# EAGLE board Robot (EAGLE 6.5.0)
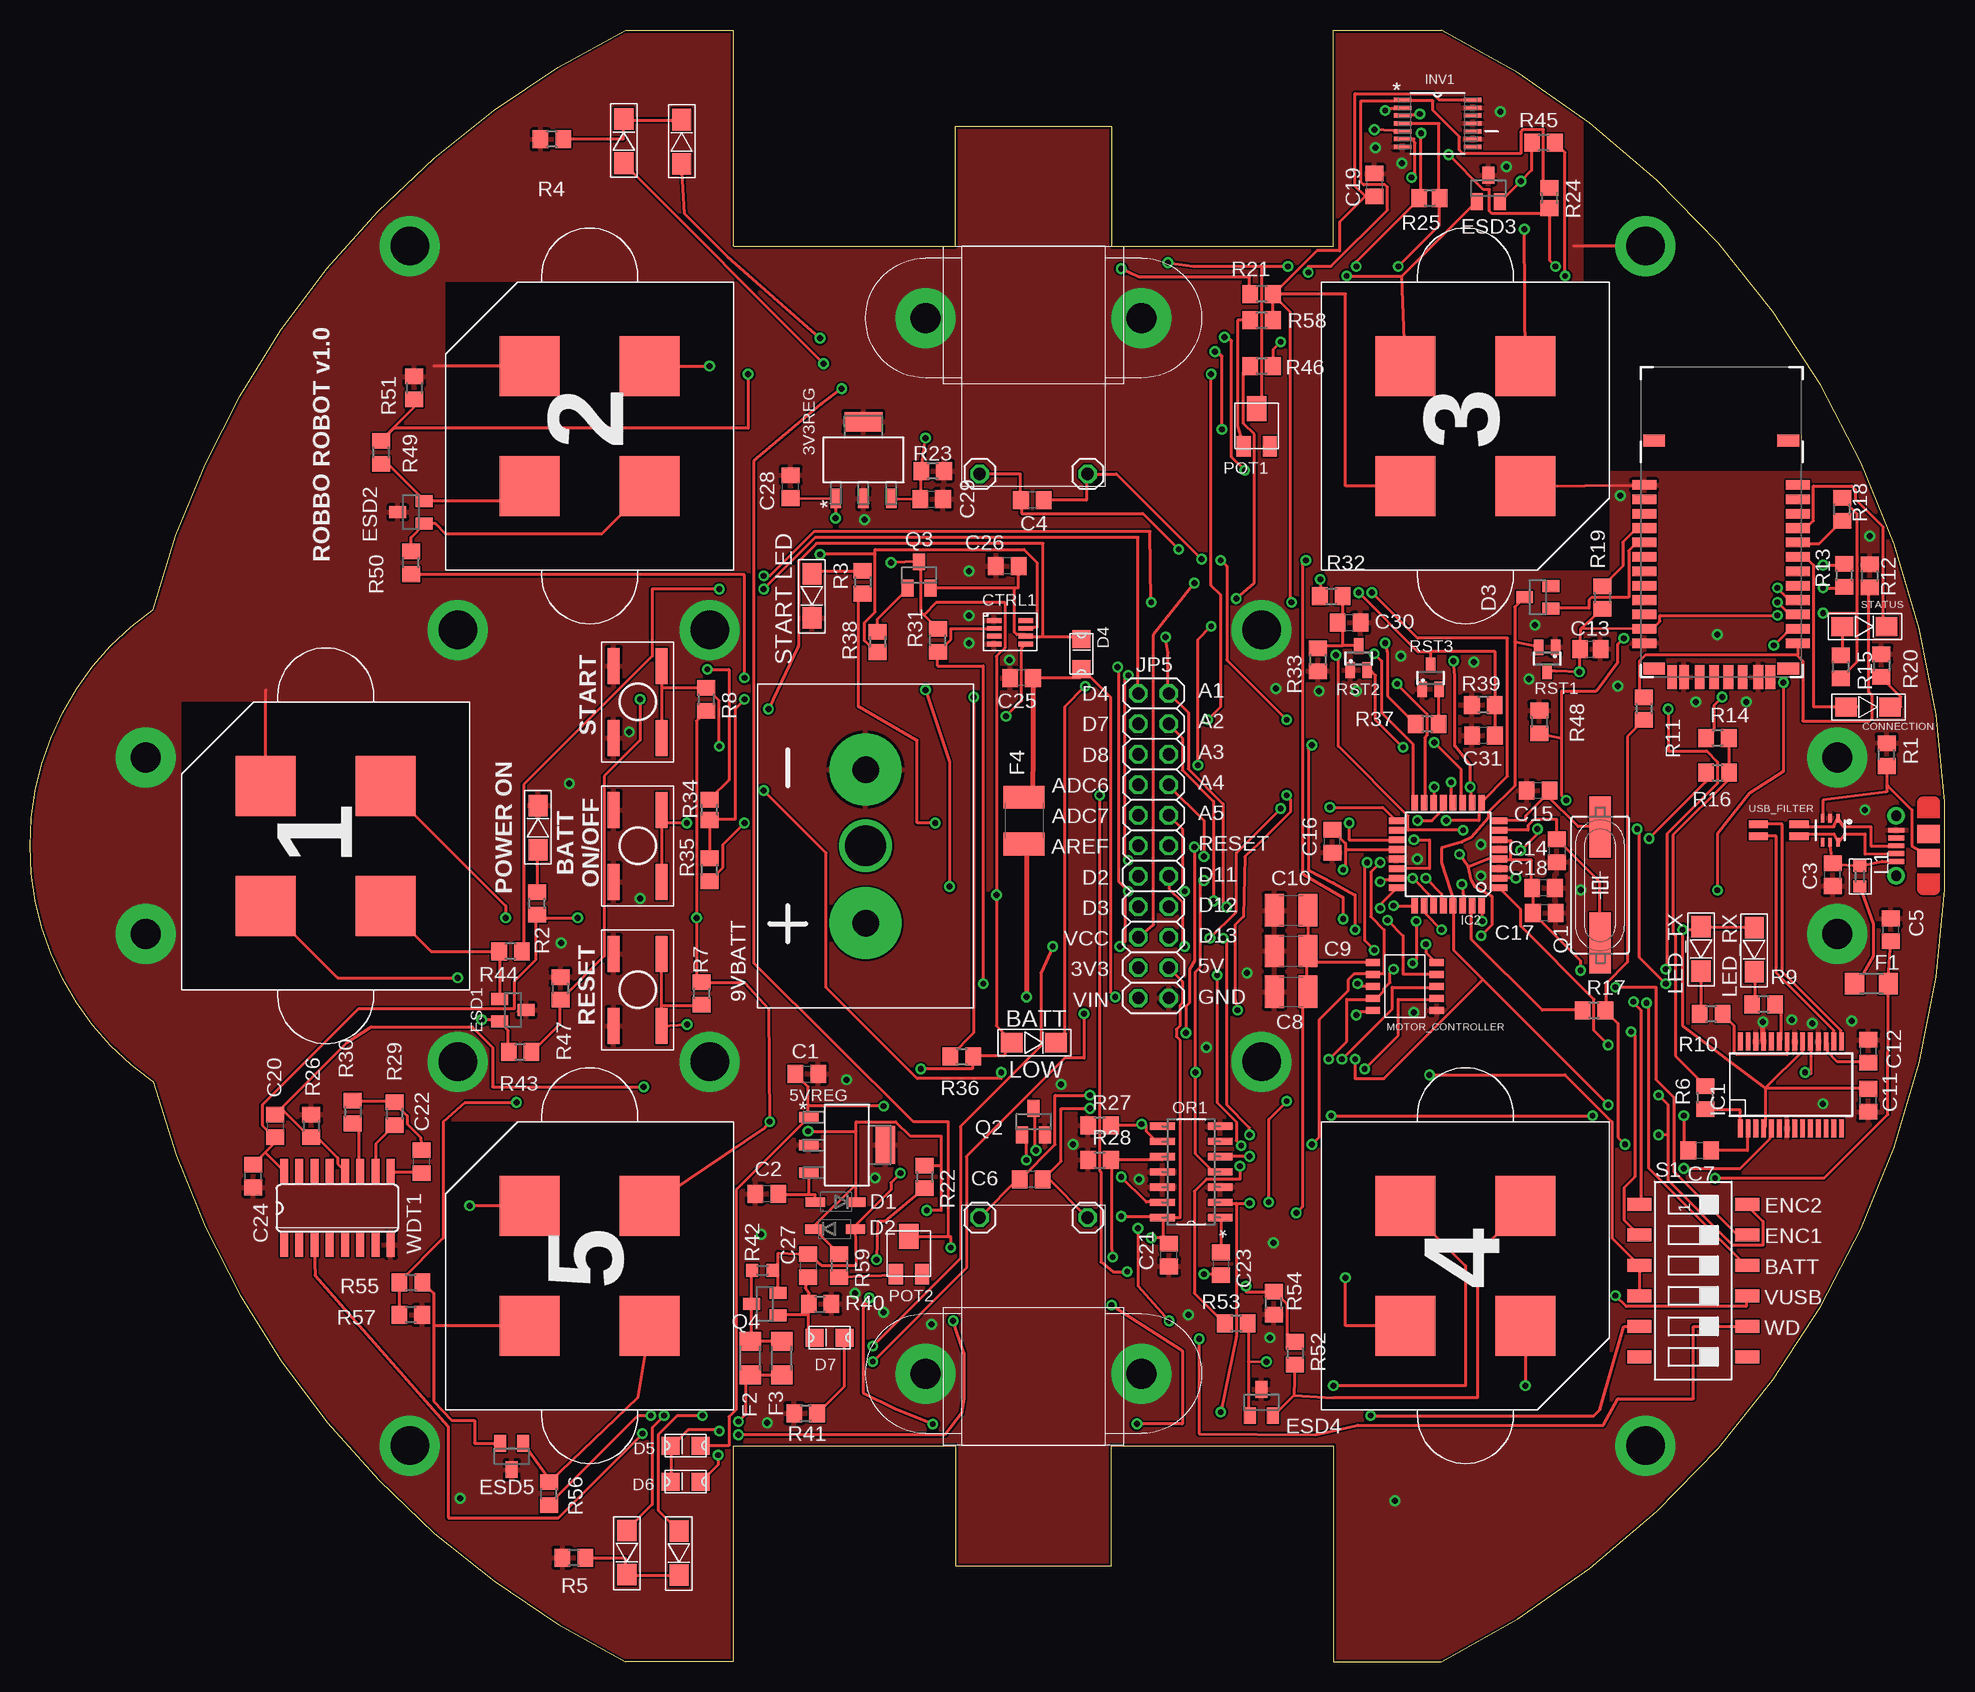
[diagram p4: board, top side]
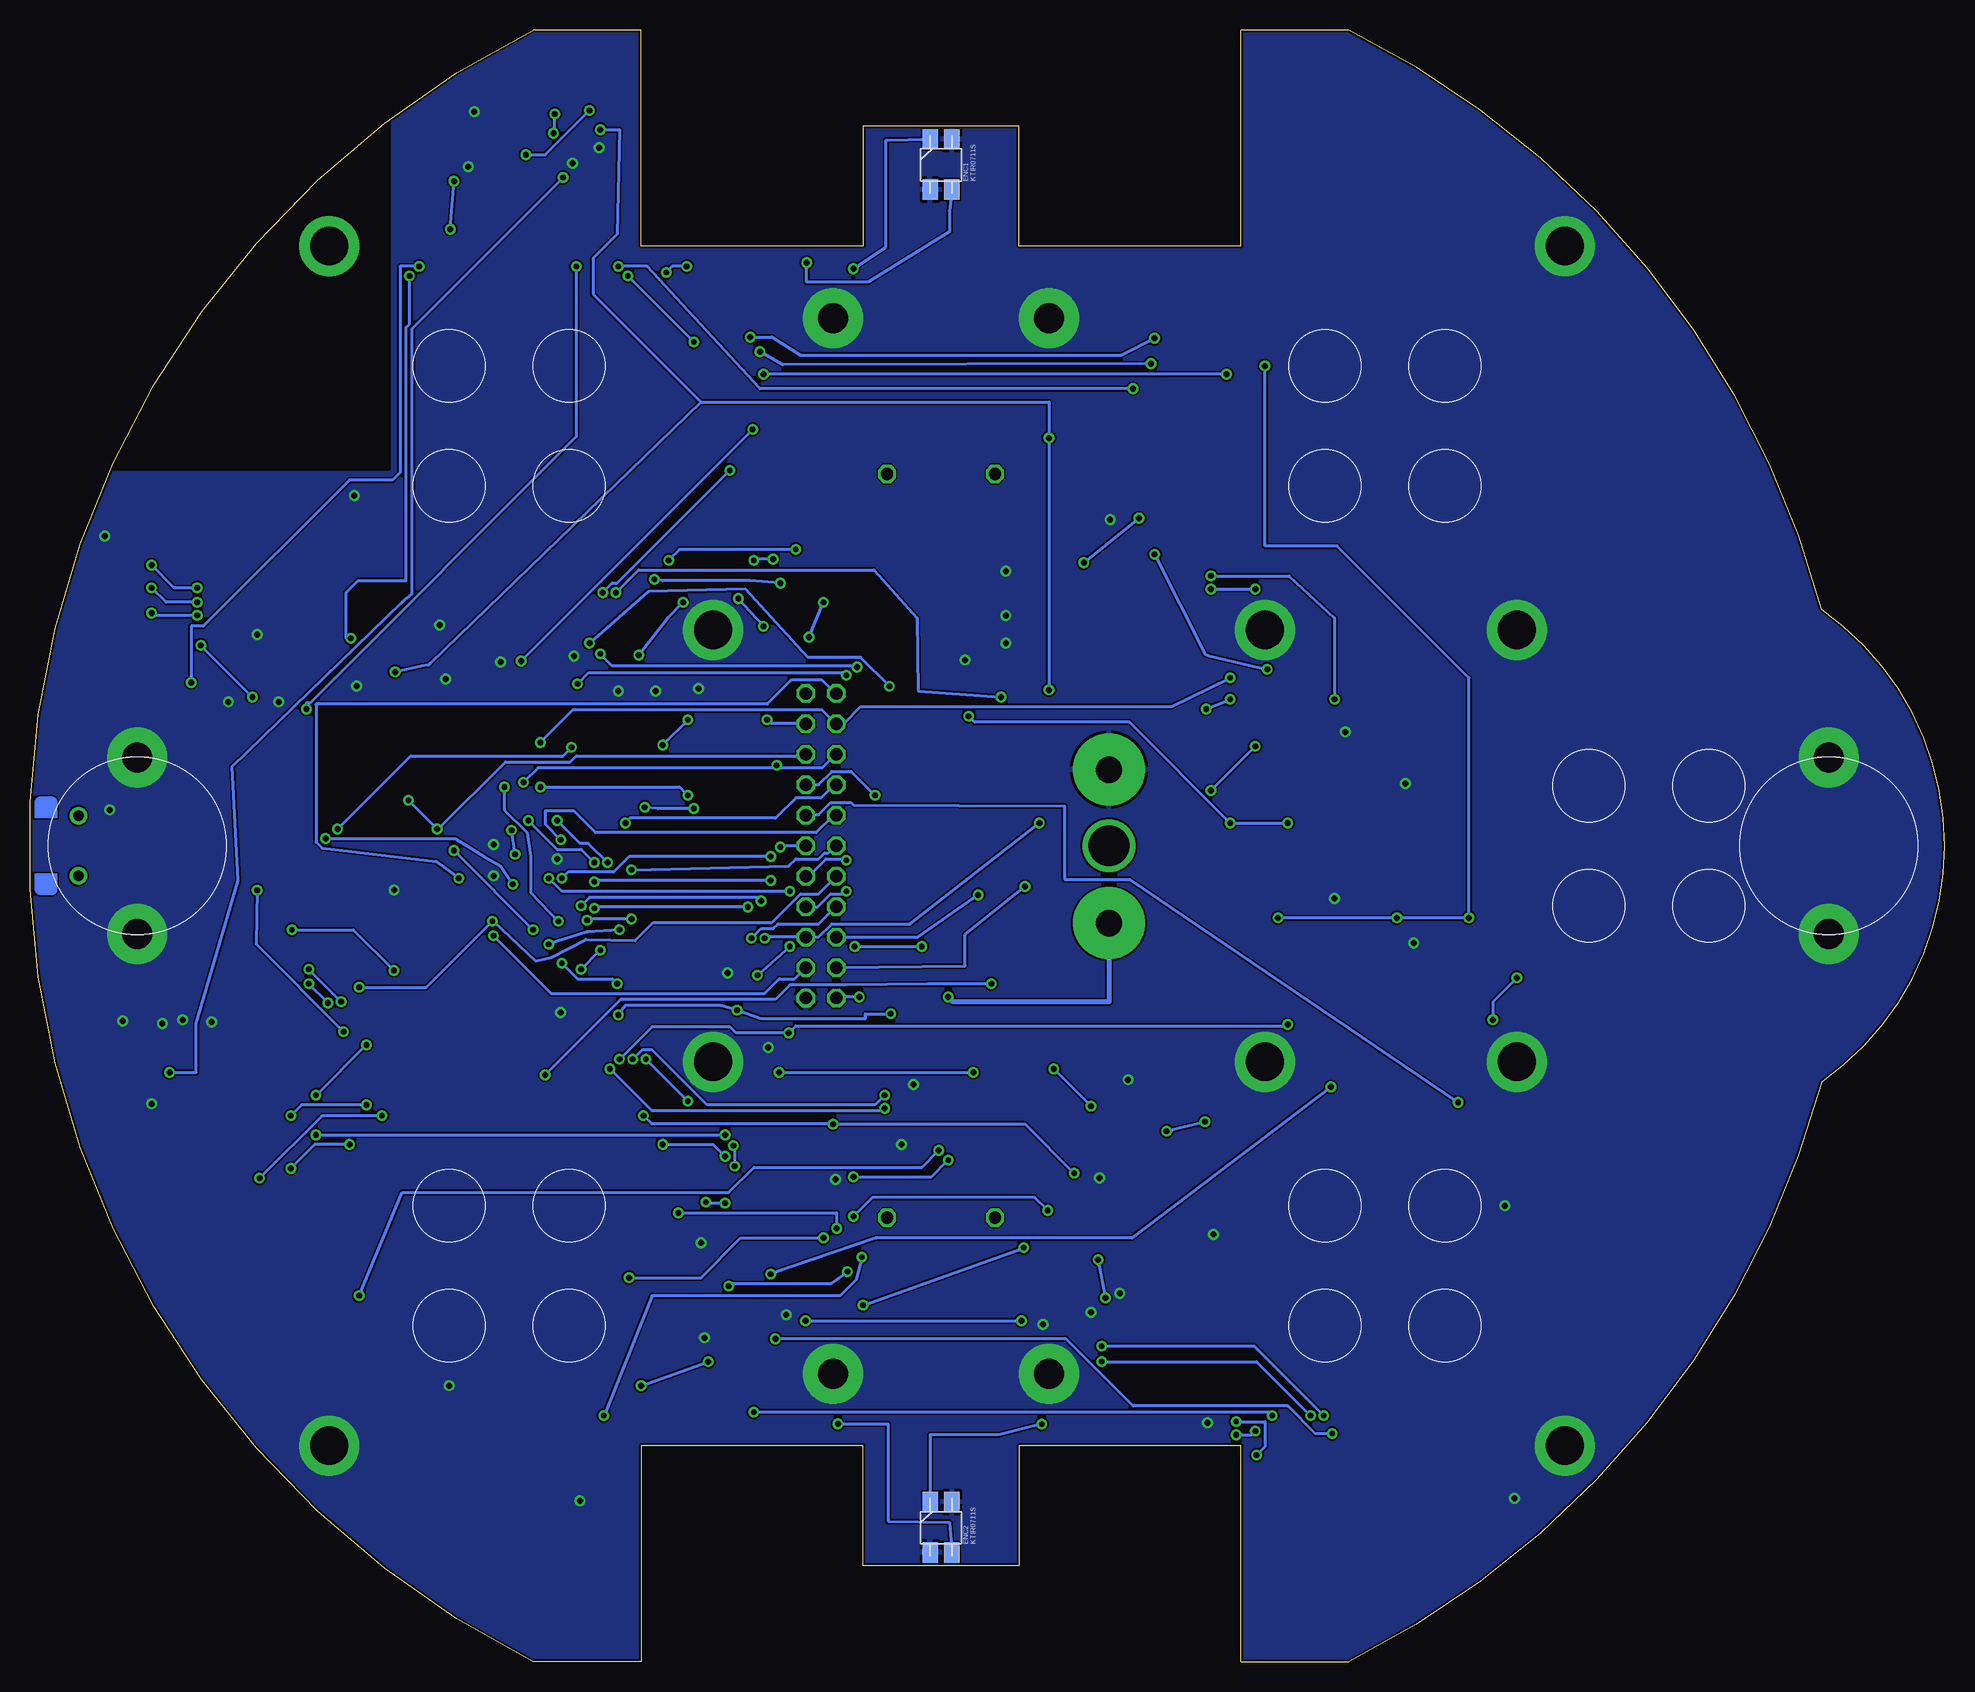
[diagram p5: board, bottom side, seen from below]

Size 159.59 x 136 mm. Coordinates in mm from the lower left corner, seen from the top.
Outline: 49.66,136 58.66,136 58.66,118 77.16,118 77.16,128 90.16,128 90.16,118 108.66,118 108.66,136 117.66,136 arc-127 117.66,0 108.66,0 108.66,18 90.16,18 90.16,8 77.16,8 77.16,18 58.66,18 58.66,0 49.66,0 arc-48 10.26,48.3 arc-110 10.26,87.7 arc-49 49.66,136
Copper layers (1*16): Top 0.035mm / dielectric 1.5mm / Bottom 0.035mm
Design rules "default *": minimum track width 10mil, minimum drill 19mil, track to track 6mil, track to pad 6mil, pad to pad 6mil, via to via 8mil, smd to smd 8mil, copper to edge 6mil, drill to drill 8mil, minimum pad ring 10mil, minimum via ring 8mil, stop-mask expansion 4mil, vias tented up to drill 50mil, thermal gap 10mil
tRestrict: area 129.7,99.4 to 154.6,129.4; area 133.8,99.3 to 137.1,101.1
bRestrict: area 129.7,99.4 to 154.6,129.4

## Footprints (pad centres in the part's own frame; a part is rotated, then mirrored left to right if it is on the bottom)
SOT230P700X180-4N = smd 1.626 x 0.889: 1 -3.2,2.311; 2 -3.2,0; 3 -3.2,-2.311 | smd 1.626 x 3.175: 4 3.2,0
BATTERY_PAC = drill 2.2 pad 6: 1 -6.45,0; 2 6.35,0 | drill 3.4: P$3 0,0
RN42 = smd 2 x 0.8: 1 0.3,16; 2 0.3,14.8; 3 0.3,13.6; 4 0.3,12.4; 5 0.3,11.2; 6 0.3,10; 7 0.3,8.8; 8 0.3,7.6; 9 0.3,6.4; 10 0.3,5.2; 11 0.3,4; 12 0.3,2.8; 13 13.1,2.8; 14 13.1,4; 15 13.1,5.2; 16 13.1,6.4; 17 13.1,7.6; 18 13.1,8.8; 19 13.1,10; 20 13.1,11.2; 21 13.1,12.4; 22 13.1,13.6; 23 13.1,14.8; 24 13.1,16 | smd 0.8 x 2: 28 9.8,0; 29 3.6,0; 30 10.8,0; 31 8.5,0; 32 7.3,0; 33 6.1,0; 34 4.9,0; 35 2.6,0 | smd 1.8 x 1: P$1 1.1,0.7; P$2 12.3,0.7; P$3 1.1,19.7; P$4 12.3,19.7
TACT_SWITCH_4_PIN = smd 3 x 1: P$1 3,-2; P$2 3,2; P$3 -3,-2; P$4 -3,2
C0805 = smd 1.3 x 1.5: 1 -0.95,0; 2 0.95,0
C1210 = smd 1.6 x 2.7: 1 -1.4,0; 2 1.4,0
C0805' = smd 1.3 x 1.5: 1 -0.85,0; 2 0.85,0
8TSOT23 = smd 1.22 x 0.4: 1 -1.21,0.78; 2 -1.21,0.13; 3 -1.21,-0.52; 4 -1.21,-1.17; 5 1.42,-1.17; 6 1.42,-0.52; 7 1.42,0.13; 8 1.42,0.78
SOD123 = smd 1.6 x 0.8: 1 -1.7,0; 2 1.7,0
SOT23 = smd 1 x 1.4: 1 -0.95,-1.1; 2 0.95,-1.1; 3 0,1.1
SD1206 = smd 1.5 x 1.5: ANODE 2.25,0; CATHODE -0.25,0
KTIR07 = smd 1.27 x 1.7: 1 0.8,3.5; 2 2.6,3.5; 3 2.6,-0.7; 4 0.8,-0.7
PT1206 = smd 1.6 x 1: 1A -1.4,-0.4; 1B -1.4,0.4; 2A 1.4,-0.4; 2B 1.4,0.4
C1812 = smd 1.9 x 3.4: 1 -1.95,0; 2 1.95,0
SSOP28 = smd 0.4 x 1.5: 1 -4.225,-3.625; 2 -3.575,-3.625; 3 -2.925,-3.625; 4 -2.275,-3.625; 5 -1.625,-3.625; 6 -0.975,-3.625; 7 -0.325,-3.625; 8 0.325,-3.625; 9 0.975,-3.625; 10 1.625,-3.625; 11 2.275,-3.625; 12 2.925,-3.625; 13 3.575,-3.625; 14 4.225,-3.625; 15 4.225,3.625; 16 3.575,3.625; 17 2.925,3.625; 18 2.275,3.625; 19 1.625,3.625; 20 0.975,3.625; 21 0.325,3.625; 22 -0.325,3.625; 23 -0.975,3.625; 24 -1.625,3.625; 25 -2.275,3.625; 26 -2.925,3.625; 27 -3.575,3.625; 28 -4.225,3.625
TQFP32-08 = smd 1.27 x 0.559: 1 -4.293,2.8; 2 -4.293,2; 3 -4.293,1.2; 4 -4.293,0.4; 5 -4.293,-0.4; 6 -4.293,-1.2; 7 -4.293,-2; 8 -4.293,-2.8; 17 4.293,-2.8; 18 4.293,-2; 19 4.293,-1.2; 20 4.293,-0.4; 21 4.293,0.4; 22 4.293,1.2; 23 4.293,2; 24 4.293,2.8 | smd 0.559 x 1.27: 9 -2.8,-4.293; 10 -2,-4.293; 11 -1.2,-4.293; 12 -0.4,-4.293; 13 0.4,-4.293; 14 1.2,-4.293; 15 2,-4.293; 16 2.8,-4.293; 25 2.8,4.293; 26 2,4.293; 27 1.2,4.293; 28 0.4,4.293; 29 -0.4,4.293; 30 -1.2,4.293; 31 -2,4.293; 32 -2.8,4.293
SOP65P640X120-14N = smd 1.473 x 0.356: 1 -2.921,1.956; 2 -2.921,1.295; 3 -2.921,0.66; 4 -2.921,0; 5 -2.921,-0.66; 6 -2.921,-1.295; 7 -2.921,-1.956; 8 2.921,-1.956; 9 2.921,-1.295; 10 2.921,-0.66; 11 2.921,0; 12 2.921,0.66; 13 2.921,1.295; 14 2.921,1.956
1X01 = drill 1.016 octagon: 1 0,0
2X11 = drill 1.016 octagon: 1 -12.7,-1.27; 2 -12.7,1.27; 3 -10.16,-1.27; 4 -10.16,1.27; 5 -7.62,-1.27; 6 -7.62,1.27; 7 -5.08,-1.27; 8 -5.08,1.27; 9 -2.54,-1.27; 10 -2.54,1.27; 11 0,-1.27; 12 0,1.27; 13 2.54,-1.27; 14 2.54,1.27; 15 5.08,-1.27; 16 5.08,1.27; 17 7.62,-1.27; 18 7.62,1.27; 19 10.16,-1.27; 20 10.16,1.27; 21 12.7,-1.27; 22 12.7,1.27
R0603 = smd 1 x 1.1: 1 -0.85,0; 2 0.85,0
LED3216_PAC = smd 1.8 x 1.6: 1 -1.84,0; 2 1.84,0
LV8548 = smd 1.18 x 0.58: 1 -1,4.6; 2 -1,3.6; 3 -1,2.6; 4 -1,1.6; 5 -1,0.6; 6 4.3,0.6; 7 4.3,1.6; 8 4.3,2.6; 9 4.3,3.6; 10 4.3,4.6
SOIC127P600X175-14N = smd 2.057 x 0.61: 1 -4.801,7.62; 2 -4.801,6.35; 3 -4.801,5.08; 4 -4.801,3.81; 5 -4.801,2.54; 6 -4.801,1.27; 7 -4.801,0; 8 0,0; 9 0,1.27; 10 0,2.54; 11 0,3.81; 12 0,5.08; 13 0,6.35; 14 0,7.62
TC33-TRIMPOT = smd 1.2 x 1.7: 1 0.5,0.3; 3 2.7,0.3 | smd 1.6 x 2.1: 2 1.6,3.45
SM49 = smd 5.08 x 1.778: 1 -4.826,0; 2 4.826,0
R0805 = smd 1.3 x 1.5: 1 -0.95,0; 2 0.95,0
R0805' = smd 1.3 x 1.5: 1 -0.85,0; 2 0.85,0
SC70-3L = smd 0.8 x 1.3: 1 -0.7,-0.95; 2 0.7,-0.95; 3 0,1.05
SMS-006 = smd 1.092 x 2.007: 1 -6.35,-4.496; 2 -3.81,-4.496; 3 -1.27,-4.496; 4 1.27,-4.496; 5 3.81,-4.496; 6 6.35,-4.496; 7 6.35,4.496; 8 3.81,4.496; 9 1.27,4.496; 10 -1.27,4.496; 11 -3.81,4.496; 12 -6.35,4.496
ROBOT_SENSOR = smd 5 x 5: 1 -5,5; 2 5,5; 3 5,-5; 4 -5,-5
SOT363 = smd 0.3 x 0.7: 1 -0.65,-1; 2 0,-1; 3 0.65,-1; 4 0.65,1; 5 0,1; 6 -0.65,1
USB-MICRO-MOLEX-105017-0001_V2 = smd 0.4 x 1.35: 1 1.2,0; 2 1.85,0; 3 2.5,0; 4 3.15,0; 5 3.8,0 | drill 0.85 pad 1.45: P$1 0,0; P$2 5,0 | smd 1.5 x 1.9: P$3 3.5,-2.7; SHIELD 1.5,-2.7
SRF3216A = smd 1.6 x 0.6: 1 -0.3,0; 2 3.1,0; 3 3.1,1; 4 -0.3,1
SO16 = smd 0.66 x 2.032: 1 -4.445,-3.073; 2 -3.175,-3.073; 3 -1.905,-3.073; 4 -0.635,-3.073; 5 0.635,-3.073; 6 1.905,-3.073; 7 3.175,-3.073; 8 4.445,-3.073; 9 4.445,3.073; 10 3.175,3.073; 11 1.905,3.073; 12 0.635,3.073; 13 -0.635,3.073; 14 -1.905,3.073; 15 -3.175,3.073; 16 -4.445,3.073

## Placement (x,y rotation side)
3V3REG  UA78M33CDCY  [SOT230P700X180-4N]  69.47,100.15 90 top
5VREG  UA78M05CDCY  [SOT230P700X180-4N]  68.1,43.05 0 top
9VBATT  BATTERY_9V  [BATTERY_PAC]  69.66,68 90 top
BT_MODULE  RN42-I/RM  [RN42]  134.26,82.08 0 top
BUTTON_ON_OFF  KSC921J  [TACT_SWITCH_4_PIN]  50.66,68 90 top
BUTTON_PROG_START  KSC921J  [TACT_SWITCH_4_PIN]  50.66,80 90 top
BUTTON_RESET  KSC921J  [TACT_SWITCH_4_PIN]  50.66,56 90 top
C1  330nF  [C0805]  64.75,48.98 0 top
C2  100nF  [C0805]  61.42,38.98 180 top
C3  10nF  [C0805]  150.26,65.6 90 top
C4  100nF  [C0805]  83.56,96.8 180 top
C5  4.7uF  [C0805]  155.12,60.99 90 top
C6  100nF  [C0805]  83.46,40.2 180 top
C7  100nF  [C0805]  139.18,42.59 180 top
C8  47uF  [C1210]  105.13,55.83 0 top
C9  47uF  [C1210]  105.13,59.23 0 top
C10  47uF  [C1210]  105.13,62.62 0 top
C11  100nF  [C0805]  153.22,46.78 90 top
C12  100nF  [C0805]  153.25,50.88 90 top
C13  100nF  [C0805']  130.06,84.41 0 top
C14  22pF  [C0805]  127.26,67.58 270 top
C15  22pF  [C0805]  125.71,72.59 180 top
C16  100nF  [C0805]  108.55,68.38 90 top
C17  4.7uF  [C0805]  126.22,62.38 180 top
C18  100nF  [C0805]  126.15,64.48 180 top
C19  100nF  [C0805]  112.05,123.08 270 top
C20  100nF  [C0805]  20.44,44.65 270 top
C21  100nF  [C0805]  94.95,33.89 90 top
C22  100nF  [C0805]  32.64,41.67 90 top
C23  100nF  [C0805]  99.25,33.15 270 top
C24  100nF  [C0805]  18.61,40.47 90 top
C25  1uF  [C0805]  82.66,82 180 top
C26  100nF  [C0805]  81.46,91.3 180 top
C27  1uF  [C0805]  64.86,33 270 top
C28  100nF  [C0805]  63.4,97.93 90 top
C29  100nF  [C0805]  75.15,96.89 0 top
C30  1uF  [C0805]  109.96,86.6 0 top
C31  1uF  [C0805]  121.16,77.2 180 top
CTRL1  LTC2955CTS8-2  [8TSOT23]  81.57,85.99 0 top
D1  MBR0520  [SOD123]  67.16,38.3 180 top
D2  MBR0520  [SOD123]  67.11,36.05 0 top
D3  BAV99  [SOT23]  125.68,88.71 90 top
D4  SD1206  [SD1206]  87.66,85 270 top
D5  SD1206  [SD1206]  53.66,18 0 top
D6  SD1206  [SD1206]  53.66,15 0 top
D7  SD1206  [SD1206]  65.66,27 0 top
ENC1  KTIR07SMD  [KTIR07]  85.36,123.4 0 bottom
ENC2  KTIR07SMD  [KTIR07]  85.36,9.8 0 bottom
ESD1  ESDA5V3L  [SOT23]  40.26,54.3 270 top
ESD2  ESDA5V3L  [SOT23]  31.76,95.8 90 top
ESD3  ESDA5V3L  [SOT23]  121.56,122.8 0 top
ESD4  ESDA5V3L  [SOT23]  102.66,21.6 0 top
ESD5  ESDA5V3L  [SOT23]  40.16,17.1 180 top
F1  500 mA  [PT1206]  153.49,56.49 0 top
F2  200 mA  [PT1206]  60.06,25.3 270 top
F3  OPEN  [PT1206]  62.66,25.3 270 top
F4  1.1/2.2A  [C1812]  82.86,70.1 270 top
IC1  FT232RL  [SSOP28]  146.78,48.07 0 top
IC2  ATMEGA328AU/TQFP  [TQFP32-08]  118.21,67.29 180 top
INV1  SN74HCT14PWR  [SOP65P640X120-14N]  117.33,128.21 0 top
JP1  1X01 PIN  [1X01]  88.16,99 0 top
JP2  1X01 PIN  [1X01]  79.16,99 0 top
JP3  1X01 PIN  [1X01]  79.16,37 0 top
JP4  1X01 PIN  [1X01]  88.16,37 0 top
JP5  2x11 HEADER  [2X11]  93.66,68 270 top
L1  600ohm/100Mhz  [R0603]  152.52,65.44 90 top
LED_BT_CONN  KPC-3216SGC  [LED3216_PAC]  153.2,79.56 0 top
LED_BT_STAT  KPC-3216SGC  [LED3216_PAC]  152.9,86.27 0 top
LED_LOW_BATT  KPC-3216EC (RED)  [LED3216_PAC]  83.68,51.58 0 top
LED_MOTOR_L1  APT3216QBC/D (BLUE)  [LED3216_PAC]  54.32,126.68 90 top
LED_MOTOR_L2  KPC-3216YC  [LED3216_PAC]  49.5,126.73 90 top
LED_MOTOR_R1  APT3216QBC/D (BLUE)  [LED3216_PAC]  54.09,9.04 270 top
LED_MOTOR_R2  KPC-3216YC  [LED3216_PAC]  49.75,9.08 270 top
LED_POWER  KPC-3216SGC (GREEN)  [LED3216_PAC]  42.34,69.5 90 top
LED_RX  KPC-3216EC (RED)  [LED3216_PAC]  143.72,59.33 270 top
LED_START  KPC-3216SGC  [LED3216_PAC]  65.18,88.84 270 top
LED_TX  KPC-3216SGC (GREEN)  [LED3216_PAC]  139.29,59.4 270 top
MOTOR_CONTROLLER  LV8548  [LV8548]  112.95,53.69 0 top
OR1  CD4072BM  [SOIC127P600X175-14N]  94.4,44.62 180 top
POT1  TC33-TRIMPOT  [TC33-TRIMPOT]  100.66,101 0 top
POT2  TC33-TRIMPOT  [TC33-TRIMPOT]  71.66,32 0 top
Q1  16MHz  [SM49]  130.88,64.72 90 top
Q2  N-MOSFET  [SOT23]  83.66,45 0 top
Q3  IRLML5203PBF (3A)  [SOT23]  74.11,90.57 0 top
Q4  IRLML5203PBF (3A)  [SOT23]  61.26,29.8 90 top
R1  0R  [R0805]  154.76,75.6 90 top
R2  1k  [R0805]  42.27,63.19 90 top
R3  1k  [R0805]  69.41,89.97 270 top
R4  1k  [R0805]  43.5,126.89 180 top
R5  1k  [R0805]  45.33,8.65 180 top
R6  1k  [R0805]  139.66,47 90 top
R7  10k  [R0805]  55.99,55.69 90 top
R8  10k  [R0805]  56.36,80.2 270 top
R9  1k  [R0805]  144.5,54.79 180 top
R10  1k  [R0805]  140.13,53.99 180 top
R11  22k  [R0805]  134.53,79.44 270 top
R12  39k  [R0805]  153.34,90.51 270 top
R13  1k  [R0805]  151.23,90.53 90 top
R14  1k  [R0805]  140.66,77 0 top
R15  1k  [R0805]  150.93,82.91 270 top
R16  1k  [R0805]  140.67,74.09 0 top
R17  1k  [R0805]  130.36,54.29 0 top
R18  1k  [R0805]  151.04,96.04 90 top
R19  1k  [R0805]  131.07,88.69 270 top
R20  1k  [R0805]  154.33,83.02 270 top
R21  220R  [R0805]  102.66,114 180 top
R22  220R  [R0805]  74.56,40.4 270 top
R23  10k  [R0805]  75.24,99.23 180 top
R24  OPEN  [R0805']  126.66,122 270 top
R25  OPEN  [R0805']  116.66,122 0 top
R26  10k  [R0805]  23.44,44.64 270 top
R27  10k  [R0805]  89.16,44.7 0 top
R28  10k  [R0805]  89.16,41.8 0 top
R29  330k  [R0805]  30.41,45.67 90 top
R30  4M7  [R0805]  26.91,45.81 270 top
R31  10k  [R0805]  75.67,85.12 90 top
R32  90k9  [R0805]  108.47,88.8 0 top
R33  100k  [R0805]  107.37,83.49 90 top
R34  100k  [R0805']  56.66,71 90 top
R35  10k  [R0805]  56.66,66 90 top
R36  120k  [R0805]  77.67,50.43 0 top
R37  1k  [R0805]  116.46,78.14 180 top
R38  100k  [R0805']  70.66,85 270 top
R39  100k  [R0805]  121.14,79.74 180 top
R40  1M  [R0805]  65.86,29.8 0 top
R41  220R  [R0805]  64.66,20.7 0 top
R42  OPEN  [R0603]  61.06,32.6 180 top
R43  220R  [R0805]  40.86,50.8 180 top
R44  220R  [R0805]  40.06,59.2 180 top
R45  220R  [R0805]  126.16,126.6 180 top
R46  220R  [R0805]  102.66,108 0 top
R47  OPEN  [R0805]  44.22,56.1 270 top
R48  OPEN  [R0805]  125.81,78.32 270 top
R49  220R  [R0805]  29.26,100.8 270 top
R50  220R  [R0805]  31.76,91.6 90 top
R51  OPEN  [R0805]  32.03,106.17 270 top
R52  220R  [R0805]  105.46,25.7 270 top
R53  220R  [R0805]  100.56,28.2 0 top
R54  OPEN  [R0805]  103.67,29.87 90 top
R55  220R  [R0805]  31.76,31.6 0 top
R56  220R  [R0805]  43.26,14 90 top
R57  OPEN  [R0805]  31.74,28.89 180 top
R58  220R  [R0805]  102.66,111.8 180 top
R59  220R  [R0805]  67.46,33 270 top
RST1  MAX803SC  [SC70-3L]  126.46,83.6 180 top
RST2  MAX803SC  [SC70-3L]  110.76,83.6 0 top
RST3  MAX803SC  [SC70-3L]  116.76,82 0 top
S1  SWS006  [SMS-006]  138.64,31.74 270 top
SENS1  ROBOT_SENSOR  [ROBOT_SENSOR]  24.66,68 0 top
SENS2  ROBOT_SENSOR  [ROBOT_SENSOR]  46.66,103 0 top
SENS3  ROBOT_SENSOR  [ROBOT_SENSOR]  119.66,103 180 top
SENS4  ROBOT_SENSOR  [ROBOT_SENSOR]  119.66,33 180 top
SENS5  ROBOT_SENSOR  [ROBOT_SENSOR]  46.66,33 0 top
TVS1  PRTR5V0U4Y  [SOT363]  150.06,69.3 180 top
U$3  [MOTOR_HOLDER]  76.16,18 0 top
U$4  [MOTOR_HOLDER]  91.16,118 180 top
USB_CONN  USB-CON-5PIN  [USB-MICRO-MOLEX-105017-0001_V2]  155.56,65.5 90 top
USB_FILTER  SRF3216A  [SRF3216A]  147.16,69.8 180 top
WDT1  4060BM  [SO16]  25.63,37.8 0 top

## Tracks (layer width: path | path; a pad name or v marks a point on that pad's centre or on a via)
+3V3  (via drill 0.48, 0.5)
  Top 0.254: 152.26,87.4 152.26,95.7 151.06,96.9 R18.2 | 152.26,87.4 152.26,83.3 150.96,82 R15.2 | v149.46,87.4 152.26,87.4 | v145.66,87.2 135.86,87.2 135.86,86.7 135.26,86.1 134.66,86.1 BT_MODULE.11 129.26,86.1 | 3V3REG.3 C29.1 R23.2 v74.66,102 | 129.26,86.1 R19.2 | 129.26,86.1 C13.1 129.16,83.06 v129.16,82.5 127.21,82.55 RST1.3 | INV1.5 v112.06,127.7 | v74.66,81 76.66,75 v76.66,64.6
  Bottom 0.254: v149.46,87.4 149.26,87.2 v145.66,87.2 | v112.06,127.7 110.46,127.7 110.66,119 112.66,117 112.66,114 103.66,105 | 103.66,105 74.66,105 v74.66,102 v74.66,81 | 103.66,105 126.26,83.2 126.41,83.05 126.96,83 v129.16,82.5 | JP5.19 81.66,58 81.66,60.6 v76.66,64.6
+5V  (via drill 0.48, 0.5)
  Top 0.254: OR1.14 94.46,37 94.46,35.3 94.86,34.9 C21.2 94.48,35.3 v93.46,35.3 | OR1.14 94.56,37 95.86,37 95.86,51.8 95.56,52.1 95.56,52.7 95.86,53 95.86,54.7 96.06,54.9 96.06,56.7 94.96,57.8 JP5.20 | D1.1 68.86,39.7 | 68.86,39.7 68.86,44.2 | 68.86,44.2 68.86,45 72.16,45 73.36,43.8 75.96,43.8 75.96,41.35 | 68.86,39.7 68.76,39.7 65.46,36.4 D2.1 R59.1 | 19.61,42.45 20.36,43.2 20.36,43.6 C20.2 20.36,43.7 19.36,44.7 19.36,46.4 27.36,54.4 40.36,54.4 40.36,56.7 42.16,58.5 42.16,62.2 R2.1 | 19.61,42.45 18.66,41.5 C24.2 | 19.61,42.45 21.16,40.9 WDT1.16 | R8.2 56.36,79.2 55.56,78.4 v55.56,62 55.56,57.1 55.96,56.7 R7.2 56.06,56.6 59.56,56.6 61.56,54.4 v61.66,45 61.16,44.4 SENS5.2 | 42.36,62.3 R2.1 | v64.86,44.2 68.86,44.2 | v90.96,37.1 94.36,37.1 OR1.14 | 111.26,122.2 110.46,123 110.46,130.7 116.96,130.7 117.46,130.2 120.16,130.2 INV1.14 | 111.26,122.2 111.96,122.2 C19.2 | R21.1 103.66,114 107.26,117.6 109.16,117.6 109.16,120 111.26,122.1 111.26,122.2 | 123.46,66.8 125.16,66.8 125.16,64.5 C18.2 125.26,64.4 125.26,62.4 C17.2 125.36,62.3 129.26,58.4 v129.26,57.6 | 123.46,66.8 122.56,66.8 IC2.4 122.46,67 121.76,67 119.91,66.25 | 123.46,66.8 123.46,68.4 122.56,68.4 IC2.6 | v119.46,69.3 114.86,69.3 | 114.86,69.3 113.96,69.3 IC2.18 | 119.91,66.25 v119.16,67.3 | 144.66,47.8 144.66,44.6 144.56,44.5 IC1.4 | 144.66,47.8 147.76,50.9 147.76,51.6 IC1.20 147.76,51.8 | 144.66,47.8 153.16,47.8 C11.2 | 143.76,61.1 LED_RX.1 143.66,61.2 139.36,61.2 LED_TX.1 139.26,61.2 139.26,61 v137.76,61 137.76,53 144.66,47.8 | v105.16,88.3 105.06,88.7 105.06,112.5 103.66,113.9 R21.1 | v108.86,83.9 109.06,83.7 109.06,76.3 114.86,70.5 114.86,69.3
  Top 0.254: v120.96,60.5 121.86,61.4 121.86,63.8 120.46,64.6 120.16,65.1 119.91,66.25 | SENS3.2 109.66,98 109.66,114 R21.1 | R2.1 42.5,62 v45.66,62 | SENS1.2 39.66,63 v39.66,62 | SENS2.2 v56.66,108 | SENS4.2 109.66,28 v109.66,32 | 75.96,41.35 75.96,37.6 v74.76,37.6 | R22.1 75.96,41.35 | R58.1 R21.1
  Bottom 0.254: v61.66,45 v64.86,44.2 | v90.96,37.1 89.36,38.7 75.86,38.7 v74.76,37.6 | v119.16,67.3 v119.46,69.3 | v129.26,57.6 132.66,61 v137.76,61 | v105.16,88.3 106.46,87 v108.86,83.9 | v120.96,60.5 116.16,55.7 98.36,55.7 97.16,56.9 95.86,56.9 94.96,57.8 JP5.20 | v55.56,62 v45.66,62 v39.66,62 39.66,82 50.66,93 56.66,93 v56.66,108 | v109.66,32 103.66,32 100.36,35.3 v93.46,35.3
ADC6  (via drill 0.48)
  Top 0.254: v109.96,69.9 109.96,68.5 113.86,68.5 IC2.19
  Bottom 0.254: v109.96,69.9 109.56,70.3 97.46,70.3 95.76,72 93.66,72 92.66,73 92.46,73 JP5.7
ADC7  (via drill 0.48)
  Top 0.254: v115.36,68.5 116.66,68.5 116.66,66.1 113.96,66.1 IC2.22
  Bottom 0.254: v115.36,68.5 116.66,69.8 116.66,70.9 114.26,70.9 112.46,69.1 94.06,69.1 92.66,70.5 92.46,70.5 JP5.9
AREF  (via drill 0.48)
  Top 0.254: 109.66,67.7 113.86,67.7 IC2.20 | 109.66,67.7 109.66,68.2 108.56,69.3 C16.2 | v109.46,66 109.66,66.3 109.66,67.7
  Bottom 0.254: v109.46,66 96.36,66.3 95.76,66.9 93.86,66.9 93.36,67.4 93.06,67.4 92.46,68 JP5.11
AUTO_DISCOVERY
  Top 0.254: R18.1 150.96,95 149.16,93.2 147.46,93.2 BT_MODULE.20
BATT_KILL-  (via drill 0.48)
  Top 0.254: v114.46,76.2 112.16,78.5 112.16,82.2 111.86,82.5 RST2.2 | v133.96,69.4 134.16,69.2 134.16,58.7 v136.36,56.5 | v134.76,54.9 134.96,54.7 134.96,41.1 143.06,33 S1.10
  Bottom 0.254: v114.46,76.2 115.16,75.5 127.86,75.5 v133.96,69.4 | v134.76,54.9 v136.36,56.5
BATT_PROT_ADJ
  Top 0.254: 109.46,84.7 107.46,84.7 R33.2 | 109.46,84.7 109.46,86.6 | 109.46,86.6 109.46,88.7 R32.2 | RST2.3 110.76,84.7 109.46,84.7 | C30.1 109.46,86.6
BAUD9600
  Top 0.254: R19.1 131.16,89.7 132.76,91.3 132.76,93.3 133.86,94.4 134.56,94.4 BT_MODULE.4
BT_CONN
  Top 0.254: LED_BT_CONN.1 152.36,79.6 148.66,79.6 148.66,91.4 148.06,92 147.46,92 BT_MODULE.19
BT_STAT
  Top 0.254: LED_BT_STAT.2 154.66,86.3 154.46,86.5 154.46,94.6 152.16,96.9 152.16,97.7 151.86,98 148.66,98 148.66,95.1 148.06,94.5 147.46,94.5 BT_MODULE.21
FTDI_RESET  (via drill 0.48)
  Top 0.254: v115.16,123.7 115.46,124 115.46,126.6 115.36,126.7 115.36,126.9 114.46,126.9 INV1.6 | IC1.19 148.46,51.6 148.46,49 147.96,49 v147.96,49.1
  Bottom 0.254: v115.16,123.7 127.76,111.1 127.76,89 128.56,88.3 142.76,74.6 142.26,65.1 145.76,53.2 145.76,49.1 v147.96,49.1
GND  (via drill 0.5, 2.5 pad 5, 3.2 pad 5)
  Top 0.254: SENS5.1 v36.66,38 | SENS3.1 BT_MODULE.1 | v134.66,118 128.66,118 | SENS2.1 33.66,108 | SENS1.1 19.66,81 | SENS4.1 v124.66,23
  Top 0.406: IC1.25 144.46,51.69 v144.46,53.3
  other vias: 74.66,24 92.66,24 31.66,18 35.66,50 9.66,60.63 9.66,75.37 35.66,86 31.66,118 74.66,112 92.66,112 102.66,86 102.66,50 134.66,18 150.66,75.37 150.66,60.63 86.96,43.1 85.96,48.1 92.46,40.2 98.06,51.2 107.46,80.9 110.56,80.9 103.86,81.1 114.26,83.8 120.36,83.3 125.46,86.4 138.86,80 143.06,80 132.36,81.3 132.56,97.2 122.56,129.2 114.36,124.9 123.06,124.6 112.16,126.2 81.66,83.5 78.26,84.9 78.26,90.9 78.26,87.2 44.26,59.9 50.86,63.6 44.96,73.2 49.96,77.5 96.56,28.9 113.76,13.4 115.36,54.1 152.96,71 60.96,35.6 68.76,30.7 71.16,29.1 75.16,28.1 35.86,13.6 151.86,53.4 148.56,53.2 146.86,53.5 149.46,46.5 120.96,68.1 120.96,65.5 129.26,64.3 115.66,66.9 70.46,40.3 68.06,48.5 103.66,34.9 153.36,93.8 101.46,57.4 69.56,95.2 140.66,85.6 56.66,86 56.66,50 124.96,81.9 61.46,19.9 103.36,27
  pour Top: -18.04,146.3 187.36,146.3 187.36,-9 -20.54,-8.2
  pour Bottom: -15.74,150.8 190.56,150.8 190.56,-7.8 -15.64,-7.8
KILL-  (via drill 0.48)
  Top 0.254: S1.4 134.16,30.5 134.16,33 S1.3 134.06,33.1 131.86,35.3 131.86,45 127.96,48.9 v116.66,48.9 | CTRL1.2 80.36,86.1 76.76,86.1 76.76,85.2 75.76,84.2 R31.1 75.66,83 79.46,83 v79.46,56.5
  Bottom 0.254: v116.66,48.9 110.36,55.2 97.46,55.2 96.26,56.4 91.56,56.4 84.76,56.5 v79.46,56.5
KILL-_DIP  (via drill 0.48)
  Top 0.254: Q2.3 83.76,46 83.76,42.7 v83.86,42.6 | v132.16,30.5 133.06,29.6 143.06,29.6 143.06,30.4 S1.9
  Bottom 0.254: v83.86,42.6 85.26,41.2 99.26,41.2 101.36,39.1 128.56,39.1 v132.16,30.5
MOTOR_L1  (via drill 0.48)
  Top 0.254: v109.36,50.2 113.56,54.4 113.56,56.2 117.16,56.2 MOTOR_CONTROLLER.8 | v88.36,47.2 85.46,47.2 85.46,43.1 82.56,40.2 C6.2 82.46,40.3 JP3.1
  Bottom 0.254: v109.36,50.2 108.56,51 107.76,51 103.16,46.4 89.16,46.4 v88.36,47.2
MOTOR_L2  (via drill 0.48)
  Top 0.254: v111.26,49.4 114.06,52.2 114.06,55.2 117.16,55.2 MOTOR_CONTROLLER.7 | v88.36,46.1 85.96,46.1 85.96,41.7 84.46,40.2 C6.1 84.76,40.4 JP4.1
  Bottom 0.254: v111.26,49.4 107.76,45.9 88.56,45.9 v88.36,46.1
MOTOR_L_ON
  Top 0.254: R4.1 49.46,126.9 49.46,128.5 LED_MOTOR_L2.2 49.56,128.5 54.26,128.5 LED_MOTOR_L1.2
MOTOR_R1  (via drill 0.48)
  Top 0.254: v116.36,59.8 116.36,59.1 117.16,58.3 MOTOR_CONTROLLER.10 | v110.46,61 110.46,63.9 108.66,64.9 106.56,66 106.56,76.1 v106.86,76.4 | v104.76,78.5 99.76,83.5 99.76,91.3 v99.26,91.8 | v97.66,91.9 90.56,99 JP1.1 88.06,99 88.06,96.8 C4.1
  Bottom 0.254: v116.36,59.8 113.16,60.8 v110.46,61 | v104.76,78.5 v106.86,76.4 | v99.26,91.8 99.16,91.9 v97.66,91.9
MOTOR_R2  (via drill 0.48)
  Top 0.254: v113.16,61.8 114.46,60.5 114.46,57.3 117.16,57.3 MOTOR_CONTROLLER.9 | v109.46,61.9 109.46,63.7 106.16,65.6 106.06,65.9 106.06,91.5 v106.36,91.8 | v95.76,92.7 92.76,95.7 82.66,95.7 82.66,96.8 C4.2 82.56,96.9 82.56,99 JP2.1
  Bottom 0.254: v113.16,61.8 113.06,61.9 v109.46,61.9 | v106.36,91.8 105.46,92.7 v95.76,92.7
MOTOR_R_ON
  Top 0.254: R5.1 46.36,8.6 49.66,8.6 49.66,7.3 LED_MOTOR_R2.2 49.86,7.2 54.06,7.2 LED_MOTOR_R1.2
N$1
  Top 0.254: D3.1 126.86,87.8 129.96,87.8 129.96,88.5 130.16,88.7 133.26,88.7 133.26,92.6 133.86,93.2 134.56,93.2 BT_MODULE.5
N$2
  Top 0.254: R38.1 70.66,86.9 73.16,89.4 Q3.1
N$3
  Top 0.254: 105.36,22.2 103.66,20.5 ESD4.2 | R52.2 105.36,22.2 | SENS4.4 120.66,34 120.66,22 108.66,22 105.36,22.2
N$4
  Top 0.254: R6.1 139.66,46 142.56,46 142.56,44.5 IC1.1
N$5
  Top 0.254: R3.1 69.36,90.9 65.26,90.9 65.26,90.7 LED_START.1
N$6  (via drill 0.48)
  Top 0.254: 70.46,92.3 70.46,87.5 69.56,86.6 69.56,85.1 70.46,84.2 70.66,84.2 R38.2 | 70.46,92.3 70.46,92.7 82.86,92.7 83.96,91.6 83.96,86.2 83.06,86.2 CTRL1.7 | v56.46,82.7 58.26,82.7 58.26,73.5 56.66,71.9 R34.2 | 70.46,92.3 v65.86,92.3
  Bottom 0.254: v65.86,92.3 61.66,84 61.26,83.8 v56.46,82.7
N$7  (via drill 0.48)
  Top 0.254: v141.06,80.4 140.36,79.7 140.36,77.6 139.76,77 R14.1 | v145.36,84.7 146.66,86 147.36,86 BT_MODULE.14
  Bottom 0.254: v145.36,84.7 v141.06,80.4
N$8  (via drill 0.48)
  Top 0.254: v112.96,84.9 113.16,84.1 113.16,80.5 115.46,78.2 R37.2 | v87.96,81.3 86.26,79.6 86.26,52.3 85.56,51.6 LED_LOW_BATT.2
  Bottom 0.254: v112.96,84.9 108.06,89.2 99.96,89.4 94.76,83.7 90.36,83.7 v87.96,81.3
N$9  (via drill 0.48)
  Top 0.254: v149.46,89.5 151.16,89.5 R13.1 | v145.66,88.3 146.66,87.3 147.36,87.3 BT_MODULE.15
  Bottom 0.254: v149.46,89.5 148.26,88.3 v145.66,88.3
N$10  (via drill 0.48)
  Top 0.254: v149.46,91.4 151.16,91.4 R13.2 | v145.66,89.5 146.66,88.5 147.36,88.5 BT_MODULE.16
  Bottom 0.254: v149.46,91.4 147.56,89.5 v145.66,89.5
N$12
  Top 0.254: C23.1 99.26,34.2 99.26,37 OR1.1
N$13  (via drill 0.5)
  Top 0.254: 101.56,25.01 101.56,28.2 R53.2 | 101.56,25.01 101.56,20.6 101.66,20.5 ESD4.1 | SENS4.3 119.66,33 119.66,23 v108.66,23 | 101.56,25.01 v103.06,25
  Bottom 0.254: v108.66,23 v103.06,25
N$14  (via drill 0.5)
  Top 0.254: ESD3.2 122.56,121.7 v124.26,123.4 125.16,124.3 125.16,126.6 R45.2 | SENS3.4 v124.56,119.4
  Bottom 0.254: v124.56,119.4 v124.26,123.4
N$15  (via drill 0.5)
  Top 0.254: R43.2 39.86,50.8 39.86,52.6 39.16,53.3 ESD1.2 39.01,53.5 v37.66,53.5 | SENS1.4 25.66,57 v35.66,57
  Bottom 0.254: v35.66,57 37.66,55 v37.66,53.5
N$16
  Top 0.254: 33.66,28 33.66,30.7 32.76,31.6 R55.2 | 33.66,28 33.66,21.7 35.16,20.1 37.06,20.1 37.06,18.2 ESD5.2 | SENS5.4 33.66,28
N$17  (via drill 0.48)
  Top 0.254: F3.2B F3.2A F2.2B F2.2A 59.66,20.6 v59.06,20 | v57.36,17.2 57.36,16.4 55.96,15 D6.ANODE
  Bottom 0.254: v57.36,17.2 56.66,17.9 56.66,20 v59.06,20
N$18
  Top 0.254: USB_FILTER.2 146.06,69.8 146.06,57.5 150.96,52.6 150.96,51.7 IC1.15
N$19
  Top 0.254: R15.1 150.96,83.9 151.06,84 151.06,86.2 LED_BT_STAT.1
N$20
  Top 0.254: ESD5.1 43.26,15.2 R56.2 50.66,22 SENS5.3
N$21
  Top 0.254: R20.2 154.36,82 155.96,80.4 155.96,79.6 LED_BT_CONN.2
N$22
  Top 0.254: R49.2 29.26,99.8 29.86,99.8 32.86,96.8 ESD2.2 40.41,96.75 SENS2.4
N$23
  Top 0.254: R50.2 31.76,93.7 32.86,94.8 ESD2.1 33.81,94.85 34.66,94 47.66,94 SENS2.3
N$25
  Top 0.254: USB_FILTER.3 145.56,68.8 145.56,57.4 150.36,52.6 IC1.16
N$26
  Top 0.254: 147.36,83.9 134.66,83.9 134.16,83.4 134.16,80.7 134.46,80.4 R11.1 | 147.36,83.9 147.36,84.8 BT_MODULE.13 | R12.2 153.26,89.5 153.26,80.8 153.56,80.5 153.56,78.6 153.36,78.4 147.76,78.4 147.76,83.4 147.36,83.8 147.36,83.9
N$27
  Top 0.254: L1.1 153.66,61.5 153.66,58.8 F1.1A F1.1B
N$28
  Top 0.254: ESD1.1 39.16,59.2 R44.2 33.46,59.2 SENS1.3
N$29  (via drill 0.48)
  Top 0.254: 101.66,114 R21.2 101.66,114.1 101.66,115.4 92.46,115.4 v90.96,116.1
  Bottom 0.254: v90.96,116.1 88.26,117.9 88.26,126.8 ENC1.1
N$30
  Top 0.254: 117.46,78.2 R37.1 117.41,81.15 RST3.2
N$31  (via drill 0.48, 0.5)
  Top 0.254: v75.26,19.8 72.06,21.1 69.46,22.4 69.46,29.5 v69.96,30.3 | R22.2 71.26,36.7 70.66,36.7 v70.56,33.5
  Bottom 0.254: ENC2.1 84.56,18.9 78.86,18.9 v75.26,19.8 | v70.56,33.5 v69.96,30.3
N$32  (via drill 0.48)
  Top 0.254: 114.36,115.5 120.56,121.7 ESD3.1 | v109.76,115.5 114.36,115.5 | v104.26,110 103.66,109.4 103.66,108 R46.2 | SENS3.3 114.36,115.5
  Bottom 0.254: v104.26,110 v109.76,115.5
N$33  (via drill 0.48, 0.5)
  Top 0.254: v115.86,129 115.86,128.9 114.46,128.9 INV1.3 | v115.96,127.4 115.96,122.1 115.86,122 R25.1 115.76,121.9 110.56,116.7 v110.56,116.3 | 76.56,35.4 76.76,35.4 v76.76,34.5 | 76.56,35.4 73.26,35.4 POT2.2 | v90.16,29.7 96.06,25.9 96.06,19.8 v92.26,19.8 | v67.66,106.1 65.96,104.8 60.36,100.1 60.36,58.2 73.66,45 76.56,45 76.56,35.4
  Bottom 0.254: v115.86,129 115.86,127.4 v115.96,127.4 | v90.16,29.7 v76.76,34.5 | v110.56,116.3 108.16,116.3 98.76,106.1 v67.66,106.1 | v92.26,19.8 88.06,19.8 88.06,11.7 82.96,11.6 ENC2.3
N$34
  Top 0.254: R29.1 30.36,44.7 28.86,43.2 28.86,40.9 WDT1.10
N$35  (via drill 0.48)
  Top 0.254: R24.1 126.66,122.9 126.16,123.4 126.16,127.7 124.46,127.7 124.26,127.5 124.26,125.7 119.46,125.7 119.16,126 119.16,127.1 116.96,129.3 116.96,130.1 114.46,130.1 INV1.1 114.36,130.1 110.96,130.1 110.96,123.3 111.16,123.1 112.96,123.1 113.16,122.9 113.16,121 108.46,116.3 106.56,116.3 v106.56,115.8 | 102.66,116.3 102.66,104.9 102.26,104.5 POT1.2 | v94.86,116.6 96.96,116.3 102.66,116.3 | 102.66,116.3 v104.86,116.3
  Bottom 0.254: v94.86,116.6 94.86,115 89.76,115 82.96,119.2 82.96,120.9 ENC1.3 | v106.56,115.8 106.06,116.3 v104.86,116.3
N$37
  Top 0.254: R42.2 60.16,32.6 Q4.3 60.16,26.8 F2.1B | F2.1B F2.1A | F3.1B F3.1A F2.1B
N$38
  Top 0.254: 64.96,38.9 65.46,38.9 D1.2 | 64.96,38.9 62.46,38.9 C2.1 | 64.96,38.9 64.96,40.7 5VREG.3
N$39
  Top 0.254: 64.86,28.9 62.36,28.9 Q4.1 | 64.86,28.9 64.86,29.8 R40.1 64.96,29.9 64.96,30.7 64.66,31.1 C27.2 | 64.86,28.9 64.86,27.5 65.36,27 D7.CATHODE
N$41
  Top 0.254: IC1.17 149.76,51.6 149.86,51.5 149.86,50.8 150.66,50 153.16,50 C12.1
N$42  (via drill 0.48)
  Top 0.254: 82.06,89.5 82.36,89.5 82.36,91.3 C26.1 | 82.06,89.5 75.16,89.5 Q3.2 | R35.2 R34.1 56.76,70.2 58.76,70.2 58.76,79.4 v59.56,80.2 | 84.46,85.4 87.66,85.4 D4.CATHODE | 84.46,85.4 83.06,85.4 CTRL1.6 82.96,85.6 82.26,85.6 82.06,85.8 82.06,89.5 | v61.56,79.4 64.06,84.7 64.06,91.7 65.56,93.2 84.46,93.2 84.46,85.4
  Bottom 0.254: v61.56,79.4 v59.56,80.2
N$43
  Top 0.254: C22.1 32.56,40.8 30.16,40.8 WDT1.9
N$44
  Top 0.254: R59.2 72.16,32.25 POT2.1
N$45
  Top 0.254: R30.2 26.96,44.8 27.46,44.3 27.46,40.9 WDT1.11
N$46
  Top 0.254: R41.2 65.66,20.7 67.86,22.9 67.86,27 D7.ANODE
N$48
  Top 0.254: R58.2 100.66,111.8 100.66,103 POT1.1
N$49
  Top 0.254: R30.1 26.96,46.7 30.36,46.7 R29.2 30.46,46.5 31.46,45.5 31.46,44.8 32.56,43.7 C22.2
N$50  (via drill 0.5)
  Top 0.406: v83.06,55.4 83.06,68 F4.2
  Bottom 0.406: 9VBATT.1 69.66,55 82.66,55 v83.06,55.4
N$53
  Top 0.254: IC2.8 122.56,70.1 124.66,70.1 124.66,70.5 126.66,72.5 C15.1 126.46,72.2 129.06,69.6 130.86,69.6 Q1.2
N$54
  Top 0.254: IC2.7 122.56,69.3 124.86,69.3 124.86,69.7 125.36,70.2 127.26,70.2 127.26,68.6 C14.1 127.36,68.5 130.86,65 130.86,59.9 Q1.1
N$57
  Top 0.254: USB_FILTER.1 147.16,69.6 150.36,69.6 TVS1.1 | 150.66,70.3 TVS1.1 | USB_CONN.3 153.46,68 153.46,69.6 151.16,69.6 TVS1.1
N$59
  Top 0.254: TVS1.6 150.76,68.3 151.26,69 152.96,69 152.96,67.3 USB_CONN.2 | USB_FILTER.4 148.16,69 150.36,69 TVS1.6 | 150.66,68.4 TVS1.6
N$64  (via drill 0.48)
  Top 0.254: 116.76,84.2 122.09,84.2 R39.1 122.11,79.74 C31.1 | v78.66,80.4 78.66,52.4 76.76,50.5 R36.1 | v110.76,89.1 115.66,84.2 116.76,84.2 | RST3.3 116.76,84.2
  Bottom 0.254: v78.66,80.4 85.56,80.9 85.66,87 89.26,91 108.86,91 v110.76,89.1
N$82
  Top 0.254: C7.1 140.16,42.6 143.16,42.6 143.16,44.4 IC1.2
N$83
  Top 0.254: TVS1.5 150.06,68 C3.2 150.36,66.5 L1.2 154.36,66.7 USB_CONN.1
N$85
  Top 0.254: IC1.23 145.86,51.7 145.96,51.8 145.96,54.4 R9.1
N$86
  Top 0.254: 144.06,54.5 R9.2 143.76,54.79 143.76,54.8 143.76,55 143.76,57.4 LED_RX.2
N$87
  Top 0.254: R10.2 139.26,54 139.26,57.5 LED_TX.2
N$88
  Top 0.254: R10.1 141.16,53.9 142.06,53 142.06,50.8 142.26,50.6 146.46,50.6 146.46,51.6 IC1.22
N$89
  Top 0.254: R2.2 42.26,64.2 42.26,67.6 LED_POWER.1
N$90  (via drill 0.48)
  Top 0.254: v119.36,64.8 119.56,63.1 119.46,63 IC2.30 | v134.96,68.6 139.66,73.3 139.66,74 R16.1
  Bottom 0.254: v119.36,64.8 120.36,66.3 121.76,67.1 124.16,68.6 v134.96,68.6
N$91
  Top 0.254: IC2.31 120.16,62.9 120.16,60.2 126.06,54.3 129.36,54.3 R17.1
ON_OFF_BT  (via drill 0.48)
  Top 0.254: BUTTON_ON_OFF.P$3 BUTTON_ON_OFF.P$1 52.76,69.9 v54.76,69.9 | v81.36,78.8 82.66,80.1 82.66,84.5 82.96,84.8 CTRL1.5 | v59.56,69.9 57.76,68.1 57.76,66.2 56.66,65.1 R35.1
  Bottom 0.254: v81.36,78.8 80.86,78.3 67.96,78.3 v59.56,69.9 v54.76,69.9
PB0  (via drill 0.48)
  Top 0.254: v118.46,73.3 118.46,71.7 118.56,71.6 IC2.12 | v100.56,88.6 102.06,89.9 102.06,102.3 101.16,103.2 101.16,107.5 101.66,108 R46.1 | v98.46,86.3 97.36,85.2 v97.36,74.7
  Bottom 0.254: v118.46,73.3 117.26,74.5 97.36,74.5 | 97.36,74.5 93.56,74.5 92.46,75.6 JP5.5 | v98.46,86.3 v100.56,88.6 | v97.36,74.7 97.36,74.5
PB1  (via drill 0.48)
  Top 0.254: v108.26,50.2 109.76,51.7 109.76,55.2 111.86,55.2 MOTOR_CONTROLLER.4 112.06,55.3 112.26,55.3 112.86,55.9 112.86,56.1 113.36,56.6 113.36,57.4 v113.66,57.7 | v104.76,46.7 103.26,45.2 v103.26,38.3 | 100.56,38.2 99.26,38.2 OR1.2 | 100.56,38.2 v101.66,38.2 | v115.66,70.1 116.86,70.1 117.66,70.9 117.66,71.4 117.76,71.5 IC2.13 | v111.46,66.6 111.26,66.4 111.26,60.1 v112.06,59.3 | v56.06,20.5 53.96,20.5 52.36,18.9 52.36,12.6 54.06,10.9 LED_MOTOR_R1.1 | v99.26,20.8 100.56,27.1 100.56,38.2
  Bottom 0.254: v104.76,46.7 v108.26,50.2 | v103.26,38.3 103.16,38.2 v101.66,38.2 | v115.66,70.1 113.76,68.2 113.06,68.2 v111.46,66.6 | v113.66,57.7 v112.06,59.3 | v56.06,20.5 56.36,20.8 v99.26,20.8
PB2  (via drill 0.48)
  Top 0.254: v110.56,53.9 110.56,54.2 111.86,54.2 MOTOR_CONTROLLER.5 | v100.66,54.3 100.46,55.3 100.46,61.4 101.16,62.1 101.26,67.1 102.46,68.2 105.06,70.8 105.06,71.9 v104.76,72.2 | v117.06,72.9 117.06,71.6 IC2.14 | v52.86,20.5 51.86,19.5 51.86,13.1 49.76,11 LED_MOTOR_R2.1 | v70.26,25 78.06,32.8 78.06,42.1 86.26,50.3 87.86,50.3 v87.86,54
  Bottom 0.254: v110.56,53.9 109.96,54.7 102.06,54.7 v100.66,54.3 98.66,53.6 89.96,53.6 89.96,54 v87.86,54 | v104.76,72.2 105.46,72.9 v117.06,72.9 | v52.86,20.5 57.36,25 v70.26,25
PB3  (via drill 0.48)
  Top 0.254: v113.96,81.5 116.46,79 116.46,77.2 116.26,77 116.26,71.6 IC2.15 | v91.56,82.2 91.26,81.9 91.26,67.1 v91.56,66.8 | v100.86,41.3 100.86,40.2 98.06,40.2 97.06,39.2 97.06,30.7 99.56,28.2 R53.1 | v100.96,43 100.56,43.4 100.56,45 98.96,46.6 v98.96,57.2 | v96.26,59.6 96.06,59.5 96.06,63.3 94.96,64.4 94.96,65.4 JP5.14
  Bottom 0.254: v113.96,81.5 113.06,82.4 91.76,82.4 v91.56,82.2 | v91.56,66.8 91.66,66.9 93.26,66.9 94.66,65.5 94.86,65.5 JP5.14 | v100.86,41.3 100.86,43 v100.96,43 | v96.26,59.6 v98.96,57.2
PB4  (via drill 0.48)
  Top 0.254: v112.06,84 112.66,83.4 112.66,79.1 115.26,76.5 115.26,71.7 115.36,71.6 IC2.16 | v90.66,82.9 90.76,82.8 90.76,65 v91.56,64.2 91.26,64.4 91.26,60 v90.86,59.6 | v51.76,20.5 50.66,20.5 43.26,13.1 R56.1 | v70.26,26.3 77.56,33.6 77.56,44.6 84.26,51.3 84.26,57.4 v85.26,59.6
  Bottom 0.254: v112.06,84 111.06,83 90.76,83 v90.66,82.9 | v91.56,64.2 91.76,64 92.86,64 93.96,62.9 94.86,62.9 JP5.16 | v51.76,20.5 57.56,26.3 v70.26,26.3 | v90.86,59.6 v85.26,59.6
PB5  (via drill 0.48)
  Top 0.254: v108.36,71.2 112.76,71.2 113.86,70.1 IC2.17 | v104.26,71.1 100.56,67.4 100.56,62.5 v98.36,60.3 | v75.46,69.9 73.96,69.9 73.96,76.8 73.86,76.8 69.06,79.6 69.06,88.7 69.36,89 R3.2
  Bottom 0.254: v108.36,71.2 107.26,71.1 v104.26,71.1 | v98.36,60.3 98.26,60.4 94.96,60.4 JP5.18 94.86,60.4 93.86,60.4 92.76,61.5 86.26,61.5 v75.46,69.9
PC0  (via drill 0.48)
  Top 0.254: 52.66,81.2 56.36,81.2 R8.1 56.46,81.1 57.46,80.1 v57.46,76.3 | BUTTON_PROG_START.P$1 52.66,81.2 | 52.66,81.2 BUTTON_PROG_START.P$3 | v112.56,65 112.56,65.2 113.86,65.2 IC2.23 | v97.86,65.1 97.56,64.8 97.56,57.9 97.16,57.5 v97.16,49.1 97.16,42.3 98.56,40.9 99.16,40.9 OR1.4 | v61.16,72.6 66.36,67.4 66.36,56.2 73.96,48.6 80.96,48.6 v80.96,49.1
  Bottom 0.254: v112.56,65 112.46,65.1 v97.86,65.1 | v61.16,72.6 v57.46,76.3 | v97.16,49.1 v80.96,49.1
PC1  (via drill 0.48)
  Top 0.254: R43.1 41.86,50.8 44.16,53.1 44.16,55.1 R47.2 44.26,55.2 47.86,58.8 47.86,73.8 50.86,76.8 v50.86,80.2 | v112.56,62.8 112.56,63.1 113.86,64.4 IC2.24 | v99.76,62.9 99.46,63.2 99.46,71.5 96.56,74.4 96.56,79.1 94.96,80.7 JP5.2 94.86,80.8 94.86,84.1 v94.66,85.4 | v61.16,90.5 61.66,90.5 65.36,94.2 93.36,94.2 v93.46,88.3
  Bottom 0.254: v112.56,62.8 112.46,62.9 v99.76,62.9 | v61.16,90.5 54.66,90.5 50.86,87 v50.86,80.2 | v94.66,85.4 v93.46,88.3
PC2  (via drill 0.48, 0.5)
  Top 0.254: R51.2 31.96,105.2 31.96,104.5 29.26,101.8 R49.1 29.46,101.9 30.36,102.8 59.86,102.8 v59.86,107.3 | v113.66,63 115.36,63 IC2.25 | v98.66,63.4 98.66,71.7 96.06,74.3 96.06,77 94.96,78.1 JP5.4 | v98.46,107.3 98.46,89.7 99.26,88.9 99.26,79.6 v98.16,78.5
  Bottom 0.254: v113.66,63 112.96,63.7 98.96,63.7 v98.66,63.4 | v98.16,78.5 97.86,78.2 94.96,78.2 JP5.4 | v59.86,107.3 v98.46,107.3
PC3  (via drill 0.48)
  Top 0.254: v117.66,61 116.36,62.3 116.36,62.8 116.26,62.9 IC2.26 | v124.26,67.6 125.66,69 v125.66,69.4 | v128.06,71.8 127.66,72.2 127.66,77 | 127.66,77 127.66,80.9 130.56,80.9 132.36,83.3 132.36,84.8 v132.86,85.3 | v127.96,115.5 127.96,125.8 127.16,126.6 R45.1 | R48.2 127.66,77
  Bottom 0.254: v124.26,67.6 v117.66,61 | v128.06,71.8 v125.66,69.4 125.56,69.4 119.96,75 114.56,75 114.06,75.5 95.06,75.5 94.96,75.6 JP5.6 | v127.96,115.5 127.96,111.5 128.26,111.2 128.26,90.1 132.26,90.1 133.26,89.1 133.26,85.3 v132.86,85.3
PC4  (via drill 0.48)
  Top 0.254: R52.1 105.46,26.4 104.76,26.2 104.76,29.8 103.76,30.8 R54.2 103.56,30.8 101.36,30.8 v101.36,31.3 | v115.26,65.3 116.86,63.7 116.86,63.1 116.96,63 IC2.27 | v97.86,67.1 97.86,70.1 94.96,73 JP5.8 | v91.46,32.5 90.26,32.5 89.26,33.3 89.26,40.8 89.16,40.9 v89.16,72.2
  Bottom 0.254: v115.26,65.3 114.76,65.8 110.96,65.8 109.66,67.1 v97.86,67.1 | v101.36,31.3 101.16,31.5 92.86,31.5 v91.46,32.5 | v89.16,72.2 91.16,74.2 92.76,74.2 93.86,73.1 94.86,73.1 JP5.8
PC5  (via drill 0.48)
  Top 0.254: R57.2 30.76,28.9 30.76,31.6 R55.1 30.86,31.7 34.46,35.3 34.46,45 36.26,46.6 v40.56,46.6 | v116.36,65.3 117.66,64 117.66,63.1 117.76,63 IC2.28 | v96.26,64.2 96.06,64.4 96.06,69.4 94.96,70.5 JP5.10
  Bottom 0.254: v116.36,65.3 115.26,64.2 v96.26,64.2 | v40.56,46.6 67.96,65.2 73.36,65.2 73.36,71.3 90.96,71.4 91.16,71.6 92.86,71.6 93.86,70.6 94.86,70.6 JP5.10
PD0/RXD
  Top 0.254: R6.2 139.66,48 137.16,50.5 137.16,60.5 136.96,60.7 136.96,68.9 141.56,73.5 141.56,74 R16.2 141.66,74.2 141.66,77 R14.2
PD1/TXD  (via drill 0.48)
  Top 0.254: R11.2 134.46,78.4 133.16,77.1 133.16,58.3 131.36,56.5 131.36,54.3 R17.2 131.36,54.2 132.36,53.2 132.36,43.7 v132.96,43.1 | v137.86,41.1 142.56,41.1 145.06,43.6 145.06,44.3 145.16,44.4 IC1.5
  Bottom 0.254: v137.86,41.1 135.86,43.1 v132.96,43.1 132.86,43.1
PD2  (via drill 0.48)
  Top 0.254: v121.06,61.7 121.06,62.9 IC2.32 | v132.16,56.2 135.56,56.2 135.56,48.5 137.06,47 137.06,40.8 142.26,35.6 143.06,35.6 S1.11
  Bottom 0.254: v132.16,56.2 126.56,56.2 v121.06,61.7 120.96,61.7 117.46,58.4 116.16,58.7 113.26,60.2 109.16,60.1 107.66,61.6 97.76,61.6 95.36,64 93.86,64 92.46,65.4 JP5.13
PD2_DIP  (via drill 0.48)
  Top 0.254: v112.96,129.3 112.96,129.5 114.36,129.5 INV1.2 | v118.26,125.6 121.16,122.7 121.66,122.7 121.66,120.9 121.86,120.7 126.66,120.7 R24.2 126.66,116.8 v127.16,116.3 | v133.46,52.5 133.76,52.2 133.76,40.4 132.86,39.5 132.86,36.8 134.06,35.6 S1.2 | v140.66,64.3 140.66,69 143.36,72.4 146.16,74.2 v146.16,81.6
  Bottom 0.254: v112.96,129.3 116.66,125.6 v118.26,125.6 | v133.46,52.5 140.76,59.8 v140.66,64.3 | v146.16,81.6 146.16,86.3 145.16,86.3 132.96,98.5 129.36,98.5 128.76,99.1 128.76,116.3 v127.16,116.3
PD3  (via drill 0.48)
  Top 0.254: v131.56,51.4 130.36,52.6 130.36,55.2 124.26,61.3 124.26,62.7 122.56,64.4 IC2.1 | v135.76,47.2 136.56,46.4 136.56,43.9 | 136.56,43.9 136.56,40.1 141.96,34.7 144.46,34.7 144.46,36.7 143.16,38 S1.12 | v99.46,60.3 99.76,60 99.76,46.4 101.66,44.5 v101.66,43.9 | 136.56,43.9 v135.76,43.9
  Bottom 0.254: v135.76,47.2 v131.56,51.4 | v99.46,60.3 98.66,61.1 97.66,61.1 97.26,61.5 93.86,61.5 92.46,62.9 JP5.15 | v135.76,43.9 v101.66,43.9
PD3_DIP  (via drill 0.48)
  Top 0.254: INV1.4 114.46,128.2 117.46,128.2 117.46,122 R25.2 117.46,121.9 117.46,119.7 v114.06,116.3 | v133.66,55 133.66,54.9 134.26,54.3 134.26,38.2 134.16,38.1 S1.1 | v136.36,57.7 136.46,57.8 136.46,69 140.66,73.2 140.66,75 139.76,75.9 136.56,75.9 v136.56,79.4
  Bottom 0.254: v136.36,57.7 v133.66,55 | v136.56,79.4 136.56,79.9 136.26,79.9 114.06,102.1 v114.06,116.3
PD4  (via drill 0.48)
  Top 0.254: v123.86,65.3 122.56,65.3 IC2.2 | v57.46,89.4 51.86,89.4 51.86,83.8 41.16,73.1 41.16,59.3 41.06,59.2 R44.1 | v61.16,89.4 65.46,93.7 92.36,93.7 92.36,80.7 JP5.1
  Bottom 0.254: v123.86,65.3 125.76,66.7 135.26,67.8 135.76,68.3 135.76,79.8 98.16,79.8 96.16,81.8 93.56,81.8 92.46,80.7 JP5.1 | v61.16,89.4 v57.46,89.4
PD5  (via drill 0.48, 0.5)
  Top 0.254: v112.56,66.6 111.76,65.8 111.76,62.1 112.86,61 112.86,57.3 MOTOR_CONTROLLER.2 111.86,57.3 110.36,57.3 109.86,56.8 109.86,55.9 107.46,53.5 107.46,43.7 v106.86,43.1 | v118.06,70.1 120.76,70.1 120.76,70.8 120.96,71 120.96,71.5 IC2.9 121.06,71.7 123.16,73.8 123.16,85.3 115.66,85.3 v111.86,89.1 | LED_MOTOR_L1.1 54.56,120.7 58.16,117.1 v65.86,110.3 | v101.26,99.3 100.16,100.4 100.16,110.1 v99.56,110.4 | v101.66,42.1 99.26,42.1 OR1.5
  Bottom 0.254: v112.56,66.6 113.66,67.7 115.66,67.7 v118.06,70.1 | v101.26,99.3 110.66,89.9 111.06,89.9 v111.86,89.1 | v101.66,42.1 102.66,43.1 v106.86,43.1 | v99.56,110.4 97.76,110.4 95.36,108.9 68.66,108.9 v65.86,110.3
PD6  (via drill 0.48, 0.5)
  Top 0.254: v110.66,56.5 110.66,56.3 111.86,56.3 MOTOR_CONTROLLER.3 | v115.26,58.2 115.56,58.5 v115.56,61.7 | IC2.10 120.16,71.6 120.16,72.8 v120.06,72.9 120.06,74.7 118.76,76.3 118.76,82.2 v118.66,83.4 | v66.16,108.2 49.56,124.8 LED_MOTOR_L2.1 | v99.36,102.7 99.36,108.8 v98.76,109.2
  Bottom 0.254: v110.66,56.5 111.06,56.9 113.96,56.9 v115.26,58.2 | v115.56,61.7 117.86,64.1 117.86,67.1 118.16,69.1 120.06,71 v120.06,72.9 | v118.66,83.4 v99.36,102.7 | v66.16,108.2 96.86,108.1 v98.76,109.2
PD7  (via drill 0.48)
  Top 0.254: v117.06,76.6 119.26,74.4 119.26,71.7 119.36,71.6 IC2.11 | v59.56,82 59.56,90.6 31.76,90.6 R50.1
  Bottom 0.254: v117.06,76.6 114.36,79.3 93.56,79.3 92.46,78.2 JP5.3 92.36,78.2 91.76,78.2 90.36,79.6 64.46,79.6 v59.56,82
RESET  (via drill 0.48, 0.5)
  Top 0.254: 123.76,85 123.76,87.9 124.56,88.7 D3.3 | 123.76,85 123.76,73 121.56,70.8 121.56,70.3 120.16,68.7 119.36,68.3 117.66,67.8 117.66,66.6 118.76,63.1 118.66,63 IC2.29 118.66,62.9 118.66,59.3 121.11,56.85 | v137.86,45.5 137.86,42.9 138.16,42.6 C7.2 | 121.11,56.85 v131.56,46.4 | 52.66,54.7 55.96,54.7 R7.1 55.96,54.6 | 52.66,54.7 BUTTON_RESET.P$3 v54.76,53.1 | 52.66,54.7 BUTTON_RESET.P$1 | v96.36,52.4 96.36,54.6 96.66,54.9 96.66,57.7 97.06,58.4 v97.06,67.9 | 121.11,56.85 112.86,48.6 110.46,48.6 v110.46,50.2 | RST1.2 123.76,85
  Bottom 0.254: v137.86,45.5 136.96,46.4 v131.56,46.4 | v97.06,67.9 96.96,68 JP5.12 | v110.46,50.2 107.76,52.9 101.26,52.9 100.76,52.4 v96.36,52.4 95.76,53 54.76,53 v54.76,53.1
SHIELD
  Top 0.254: R1.1 154.76,73 | 154.76,73 154.76,72.5 149.46,71.8 149.46,70.4 TVS1.3 | USB_CONN.SHIELD 158.26,67.2 156.86,68 156.86,71 154.86,73 154.76,73
USB/WD_KILL-  (via drill 0.48)
  Top 0.254: v83.06,41.8 83.06,43.6 82.76,43.9 Q2.1 | v90.96,40.4 93.06,38.3 94.36,38.3 OR1.13
  Bottom 0.254: v83.06,41.8 84.46,40.4 v90.96,40.4
USB_VCC  (via drill 0.48)
  Top 0.254: 62.36,32.2 61.96,32.6 R42.1 | Q4.2 62.36,32.2 | 92.66,44.7 93.06,44.7 93.06,44.2 93.86,43.4 94.36,43.4 OR1.9 | 92.66,44.7 R27.2 | v140.46,40.3 149.56,40.3 154.86,45.6 F1.2A F1.2B C5.1 | v108.46,45.5 v130.26,45.5 | v92.66,44.8 92.66,44.7 | v72.56,40.7 71.76,39.9 71.76,39.3 68.86,36.4 D2.2 68.76,36.3 68.86,33 66.06,33 C27.1 62.36,34.05 62.36,32.2
  Bottom 0.254: v140.46,40.3 135.26,45.5 v130.26,45.5 | v108.46,45.5 107.76,44.8 v92.66,44.8 76.66,44.8 v72.56,40.7
VCC  (via drill 0.48, 0.5)
  Top 0.254: D5.ANODE 58.26,18 58.26,20.4 58.86,21 58.86,39.3 64.86,45.3 5VREG.1 64.86,45.4 64.86,46.3 | 64.86,46.3 64.86,47.9 63.86,48.9 C1.1 | 74.51,87.25 75.66,86.1 R31.2 | 74.51,87.25 74.26,87.5 74.26,91.5 74.16,91.6 Q3.3 v71.76,91.6 | 74.51,87.25 75.56,88.3 81.26,88.3 81.26,84.5 80.56,83.8 v80.56,63.9 80.56,53 81.86,51.7 LED_LOW_BATT.1 81.76,51.5 81.26,51 81.26,50.5 78.66,50.5 R36.2 78.56,50.4 78.56,49.4 v74.26,49.4 | v71.16,46.3 64.86,46.3 | v107.56,90.2 107.56,88.8 R32.1 | 92.36,60.3 JP5.17 92.46,60.4 93.66,61.4 93.66,85.6 v97.06,89.9 | C28.1 3V3REG.1 v67.16,95.3
  Bottom 0.254: v74.26,49.4 v71.16,46.3 | v107.56,90.2 106.86,90.1 99.56,90.1 v97.06,89.9 | v80.56,63.9 85.56,60.4 92.36,60.4 JP5.17 | v67.16,95.3 v71.76,91.6
VIN  (via drill 0.48)
  Top 0.254: C25.1 87.56,82 87.56,82.6 87.66,82.7 D4.ANODE 87.76,82.7 90.06,80.4 90.06,55.8 v90.46,55.4
  Top 0.406: C25.1 83.61,76.4 83.56,72 F4.1
  Bottom 0.254: v90.46,55.4 92.26,55.4 92.36,55.3 JP5.21
VMOT  (via drill 0.48, 0.5)
  Top 0.254: MOTOR_CONTROLLER.1 111.86,58.3 106.56,58.3 106.56,58.6 C9.2 | C10.2 106.56,62.1 106.56,58.7 C9.2 | D6.CATHODE 53.46,15 53.46,18 D5.CATHODE 53.56,18 54.86,19.3 57.46,19.3 v57.46,19.2 | v59.06,18.9 76.26,18.9 77.66,20.7 77.86,21.9 77.86,25.7 v76.96,28.4 | v92.36,36.1 92.36,31.3 v94.96,28.4 | v105.56,37.4 106.06,37.9 106.06,54.7 106.36,55 C8.2 106.46,55.1 106.46,58.1 106.56,58.2 C9.2
  Bottom 0.254: v57.46,19.2 57.76,18.9 v59.06,18.9 | v92.36,36.1 92.36,37.4 v105.56,37.4 | v94.96,28.4 v76.96,28.4
WD_HEARTBEAT  (via drill 0.48)
  Top 0.254: v97.86,32.3 99.16,32.3 C23.2 | v51.16,47.9 38.56,47.9 38.56,51.2 36.86,52.9 28.46,52.9 26.46,51.6 20.46,45.6 C20.1 21.06,46.1 21.06,46 23.36,43.7 R26.2 23.56,43.7 23.96,43.7 25.66,42 25.66,41.5 26.26,40.9 WDT1.12
  Bottom 0.254: v97.86,32.3 89.06,35.3 67.76,35.3 v51.16,47.9
WD_OUT  (via drill 0.48)
  Top 0.254: v97.46,26.9 97.46,19 107.16,18.9 110.66,19.7 131.16,19.7 132.36,21.9 138.66,21.9 138.66,27.93 S1.8 | v51.06,19 44.06,12 34.86,12 34.86,19.6 23.76,32.2 23.76,32.7 WDT1.3
  Bottom 0.254: v97.46,26.9 73.26,26.9 67.66,21.3 54.76,21.3 52.46,19 v51.06,19
WD_OUT_DIP  (via drill 0.48)
  Top 0.254: OR1.10 94.36,42 94.36,41.8 R28.2 90.16,41.7 90.16,34.5 v90.26,33.7 | v111.76,20.5 130.36,20.5 130.86,21 132.86,27.93 S1.5
  Bottom 0.254: v111.76,20.5 107.76,30.5 92.06,30.5 90.76,31.8 v90.26,33.7

## Text on the board
tPlace: START LED | START | POWER ON | BATT / ON/OFF | RESET | A1 / A2 / A3 / A4 / A5 / RESET / D11 / D12 / D13 / 5V / GND | D4 / D7 / D8 / ADC6 / ADC7 / AREF / D2 / D3 / VCC / 3V3 / VIN | BATT / / LOW | ENC2 / ENC1 / BATT / VUSB / WD
tNames: ROBBO ROBOT v1.0 | 2 | 3 | STATUS | CONNECTION | 1 | 5 | 4